# Altium schematic sheet Tartarus Joystick Mod M0.SchDoc
size A; Engineer: Will Snyder; Revision: 1.0 - ES; SheetNumber: 1; SheetTotal: 2; DocumentTitle: MCU, Joystick, and 3V3 Supply
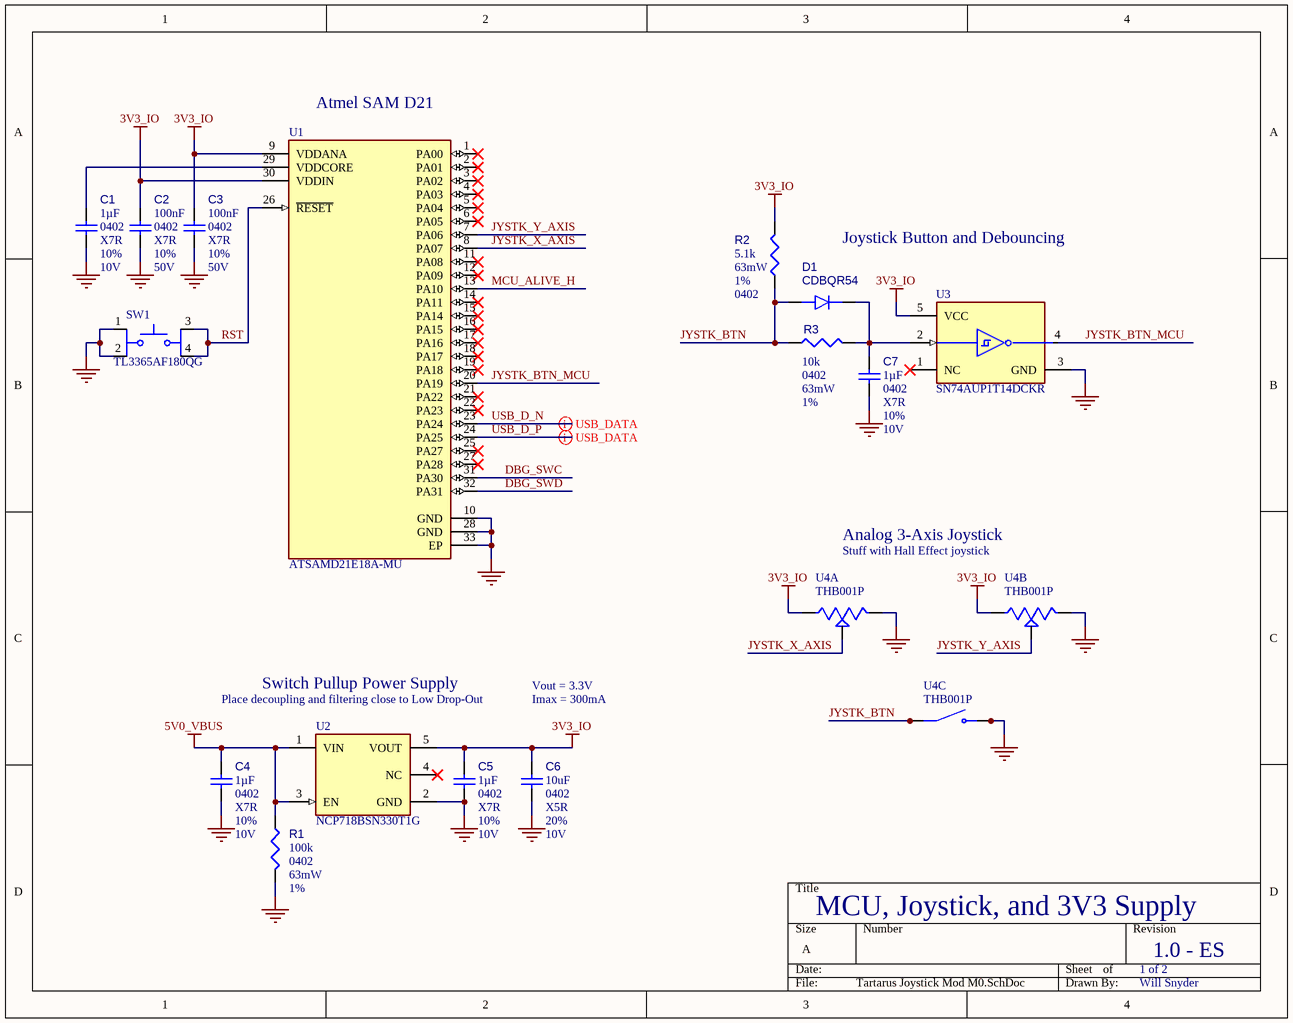
[diagram p0: Tartarus Joystick Mod M0.SchDoc]

## Parts
C1  value 1µF  Case/Package: 0402  Voltage Rating: 10V  Capacitor Type: X7R  Tolerance: 10%  [CAPC1005X55X30NL05T10]  (hidden comment: GRM155Z71A105KE01D)
C2  value 100nF  Voltage Rating: 50V  Capacitor Type: X7R  Case/Package: 0402  Tolerance: 10%  [CAPC1005X55X30NL05T10]  (hidden comment: 04025C104KAT4A)
C3  value 100nF  Voltage Rating: 50V  Capacitor Type: X7R  Case/Package: 0402  Tolerance: 10%  [CAPC1005X55X30NL05T10]  (hidden comment: 04025C104KAT4A)
C4  value 1µF  Case/Package: 0402  Voltage Rating: 10V  Capacitor Type: X7R  Tolerance: 10%  [CAPC1005X55X30NL05T10]  (hidden comment: GRM155Z71A105KE01D)
C5  value 1µF  Case/Package: 0402  Voltage Rating: 10V  Capacitor Type: X7R  Tolerance: 10%  [CAPC1005X55X30NL05T10]  (hidden comment: GRM155Z71A105KE01D)
C6  value 10uF  Capacitor Type: X5R  Voltage Rating: 10V  Tolerance: 20%  Case/Package: 0402  [CAPC1005X55X30NL05T10]  (hidden comment: GRM155R61A106ME11J)
C7  value 1µF  Case/Package: 0402  Voltage Rating: 10V  Capacitor Type: X7R  Tolerance: 10%  [CAPC1005X55X30NL05T10]  (hidden comment: GRM155Z71A105KE01D)
D1  CDBQR54  [Chip2PinSM127P600-8N]
R1  value 100k  Power: 63mW  Case/Package: 0402  Tolerance: 1%  [RESC0402(1005)_L]  (hidden comment: 100KR2F)
R2  value 5.1k  Power: 63mW  Tolerance: 1%  Case/Package: 0402  [RESC1005X40X25NL05T05]  (hidden comment: MCS04020C5101FE000)
R3  value 10k  Power: 63mW  Tolerance: 1%  Mounting Technology: 0402  [RESC1005X40X25NL05T05]  (hidden comment: MCS04020C2202FE000)
SW1  TL3365AF180QG  [SW_TL3365AF180QG]
U1  ATSAMD21E18A-MU  [FP-PG-IPC_A]
U2  NCP718BSN330T1G  [SOT95P280X100-5N]
U3  SN74AUP1T14DCKR  [FP-DCK0005A-IPC_B]
U4  THB001P  [CNK_THB001P]  (parts A,B,C of 3)

## Nets
3V3_IO: C2.1 C3.1 C5.1 C6.1 R2.2 U1.9(VDDANA) U1.30(VDDIN) U2.5(VOUT) U3.5(VCC) U4.VR1_1 U4.VR2_1
5V0_VBUS: C4.1 R1.1 U2.1(VIN) U2.3(EN)
GND: C1.2 C2.2 C3.2 C4.2 C5.2 C6.2 C7.2 R1.2 SW1.1 SW1.2 U1.10(GND) U1.28(GND) U1.33(EP) U2.2(GND) U3.3(GND) U4.A(NO) U4.B(NO) U4.VR1_3 U4.VR2_3
DBG_SWC: U1.31(PA30)
DBG_SWD: U1.32(PA31)
JYSTK_BTN: D1.2(A) R2.1 R3.1 U4.C(COM) U4.D(COM)
JYSTK_BTN_MCU: U1.20(PA19) U3.4(Y)
JYSTK_X_AXIS: U1.8(PA07) U4.VR1_2
JYSTK_Y_AXIS: U1.7(PA06) U4.VR2_2
MCU_ALIVE_H: U1.13(PA10)
RST: SW1.3 SW1.4 U1.26(~{RESET})
USB_D_N: U1.23(PA24)
USB_D_P: U1.24(PA25)
NetC1_1: C1.1 U1.29(VDDCORE)
NetC7_1: C7.1 D1.1(K) R3.2 U3.2(A)

Not connected (* = marked no-connect by the designer): U1 1(PA00)* 2(PA01)* 3(PA02)* 4(PA03)* 5(PA04)* 6(PA05)* 11(PA08)* 12(PA09)* 14(PA11)* 15(PA14)* 16(PA15)* 17(PA16)* 18(PA17)* 19(PA18)* 21(PA22)* 22(PA23)* 25(PA27)* 27(PA28)*; U2 4(NC)*; U3 1(NC)*

## Layout directives
differential pair: USB_D_N, USB_D_P

## Notes on the sheet
- (near U1) Atmel SAM D21
- Joystick Button and Debouncing
- Analog 3-Axis Joystick
- Stuff with Hall Effect joystick
- (near U2) Place decoupling and filtering close to Low Drop-Out
- Switch Pullup Power Supply
- Vout = 3.3V
- Imax = 300mA
- 1 of 2

## Library data of the parts
C1 C4 C5 C7 = CMP-001-00092-1: Ceramic Capacitor, Multilayer, Ceramic, 10V, 10% +Tol, 10% -Tol, X7R, 15% TC, 1uF, Surface Mount, 0402; Mounting Technology: Surface Mount; Max Operating Temperature: 125°C; Pins: 2; RoHS Compliant: Yes; Min Operating Temperature: -55°C
C2 C3 = CMP-001-00090-1: Ceramic Capacitor, Multilayer, Ceramic, 50V, 10% +Tol, 10% -Tol, X7R, 15% TC, 0.1uF, Surface Mount, 0402; Pins: 2; RoHS Compliant: Yes
C6 = CMP-001-00091-1: Ceramic Capacitor, Multilayer, Ceramic, 10V, 20% +Tol, 20% -Tol, X5R, 15% TC, 10uF, Surface Mount, 0402
D1 = CMP-004-00041-1: Rectifier Diode, Schottky, 1 Phase, 1 Element, 0.2A, 30V V(RRM), Silicon; Forward Voltage: 240mV; RoHS Compliant: Yes; Max Operating Temperature: 125°C
R1 = CMP-009-00064-2: 100K 0.063W 1% 0402 (1005 Metric)  SMD; Mounting Technology: SMT; Pins: 2
R2 = CMP-009-00205-1: Fixed Resistor, Thin Film, 0.063W, 5100ohm, 50V, 1% +/-Tol, 50ppm/Cel, Surface Mount, 0402; Min Operating Temperature: -55°C; Pins: 2; Max Operating Temperature: 125°C; Mounting Technology: Surface Mount; RoHS Compliant: Yes
R3 = CMP-009-00206-1: Fixed Resistor, Thin Film, 0.063W, 22000ohm, 50V, 1% +/-Tol, 50ppm/Cel, Surface Mount, 0402; Case/Package: 0402; Min Operating Temperature: -55°C; Pins: 2; RoHS Compliant: Yes; Max Operating Temperature: 125°C
SW1 = CMP-011-00019-2: Tactile Switch SPST-NO Top Actuated Surface Mount; MF: E-Switch; MP: TL3365AF180QG; Case/Package: None; Availability: In Stock; SnapEDA_Link: https://www.snapeda.com/parts/TL3365AF180QG/E-Switch/view-part/?ref=snap; Check_prices: https://www.snapeda.com/parts/TL3365AF180QG/E-Switch/view-part/?ref=eda; Value: *; Pins: 4; Price: None; Purchase-URL: https://pricing.snapeda.com/search/part/TL3365AF180QG/?ref=eda; Component Type: Standard; Design Item ID: TL3365AF180QG; Source: TL3365AF180QG.SchLib
U1 = CMP-020-00023-1: RISC Microcontroller, 32-Bit, FLASH, CORTEX-M0 CPU, 48MHz, CMOS; Max Supply Voltage: 3.63V; Clock Frequency: 32MHz; Min Supply Voltage: 1.62V; Nominal Supply Voltage: 3.3V; RoHS Compliant: Yes; Max Operating Temperature: 85°C; Pins: 32; Case/Package: HVQCCN; Min Operating Temperature: -40°C
U2 = CMP-019-00058-1: Fixed Positive LDO Regulator, 3.3V, 440V Dropout, PDSO5; RoHS Compliant: Yes
U3 = CMP-016-00010-1: Inverter, AUP/ULP/V Series, 1-Func, 1-Input, CMOS, PDSO5; Min Supply Voltage: 2.3V; Nominal Supply Voltage: 2.5V; Max Supply Voltage: 3.6V; Logic Type: INVERTER; Pins: 5; RoHS Compliant: Yes; Min Operating Temperature: -40°C; Max Operating Temperature: 85°C; Case/Package: TSSOP
U4 = CMP-062-000000-2: Joystick, 2 - Axis Analog (Resistive) Output; MF: C&K; Package: None; SnapEDA_Link: https://www.snapeda.com/parts/THB001P/C%2526K/view-part/?ref=snap; Component Type: Standard; Check_prices: https://www.snapeda.com/parts/THB001P/C%2526K/view-part/?ref=eda; Value: *; Pin Count: 10; Purchase-URL: https://pricing.snapeda.com/search/part/THB001P/?ref=eda; Design Item ID: THB001P; Source: THB001P.SchLib; MP: THB001P; Availability: In Stock; Price: None